# EAGLE schematic CV-module-schematics (EAGLE 6.2)

## Sheet 1 of 2
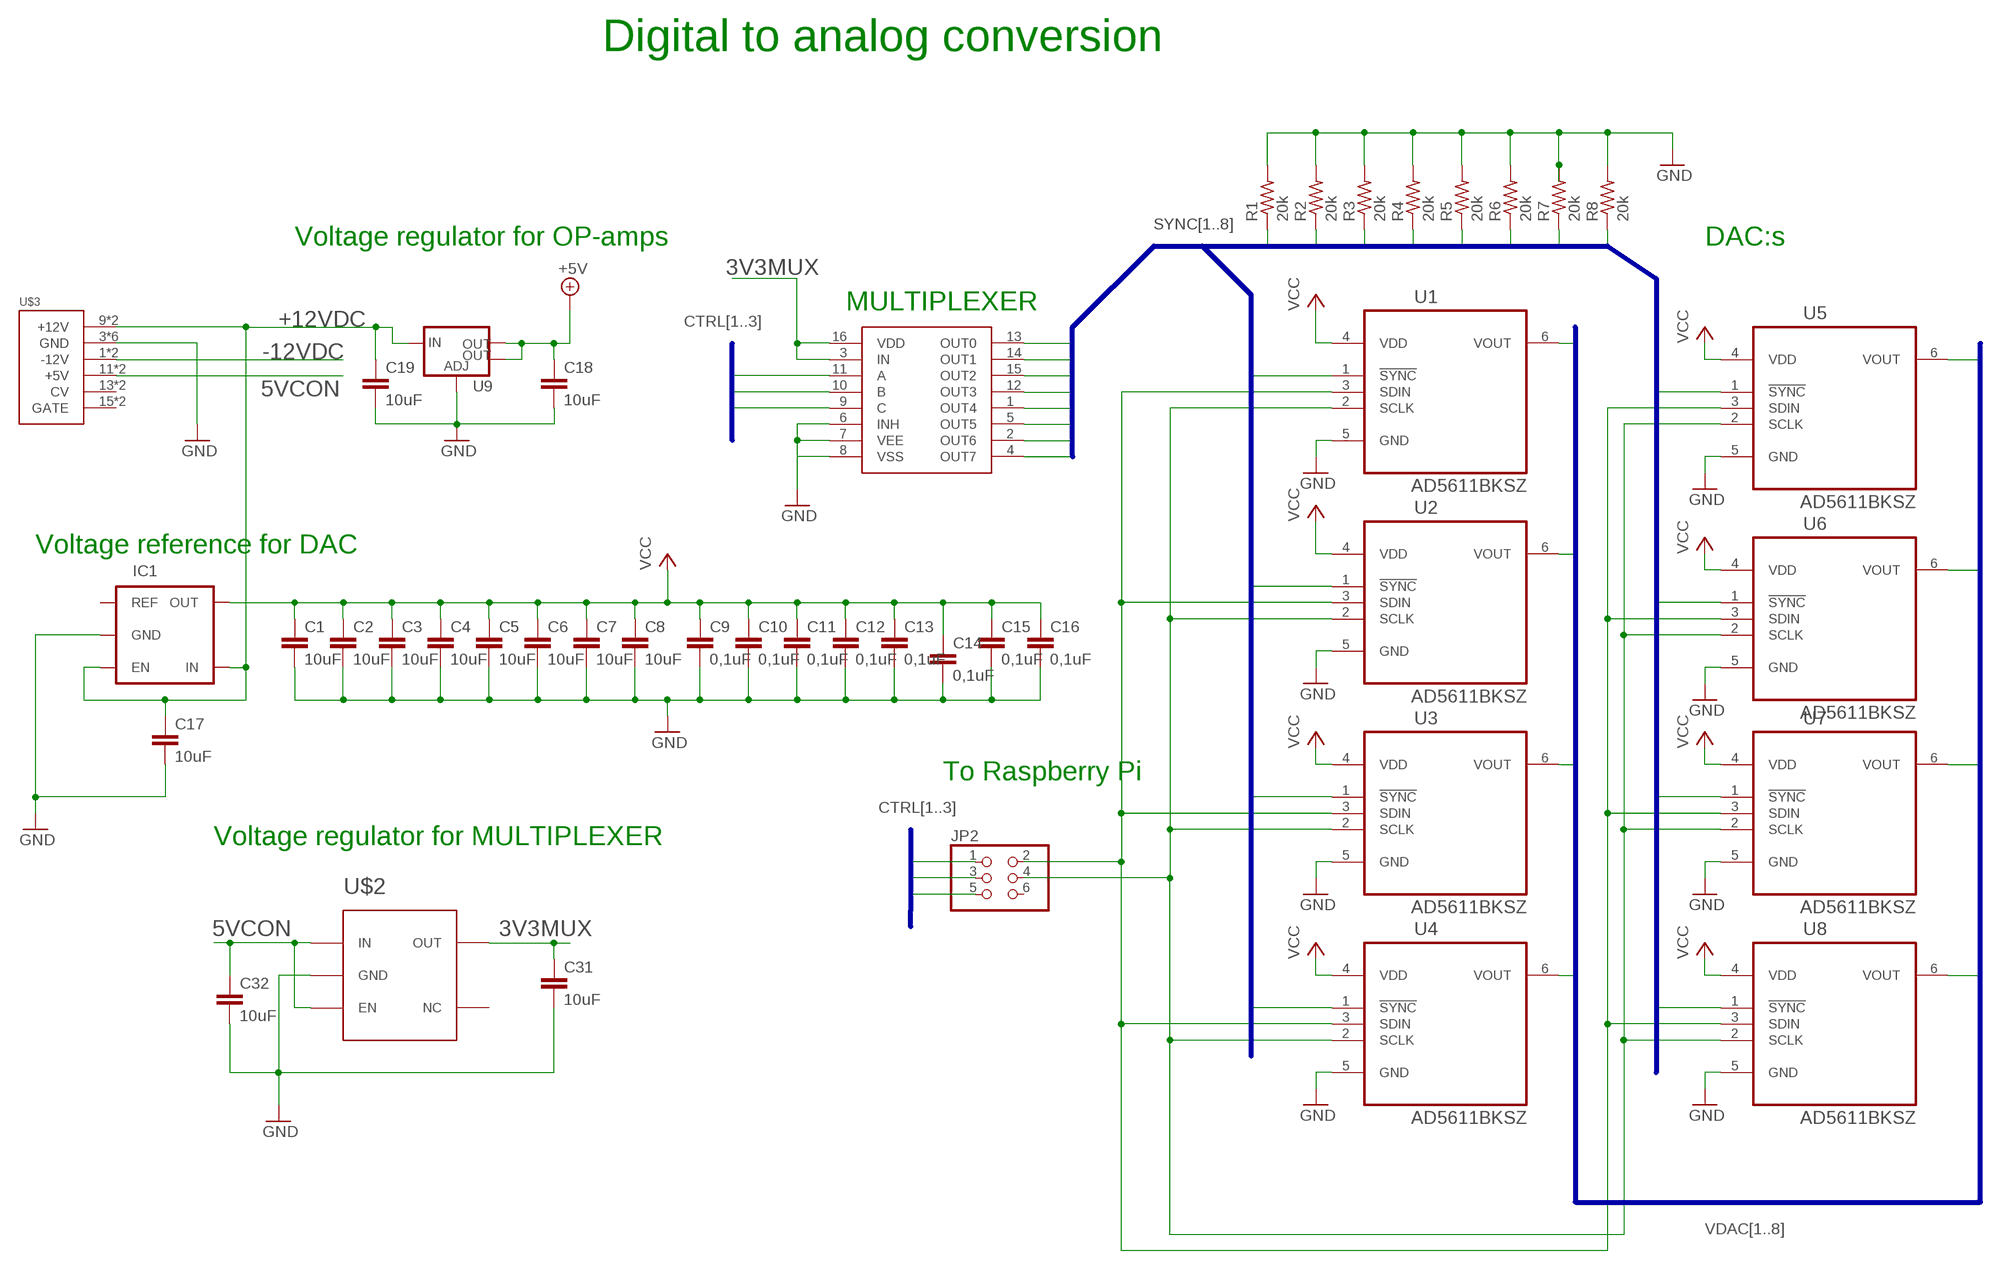
[diagram p0: schematic, sheet 1]

### Parts
C1  10uF  C-EUC1206  [C1206]
C2  10uF  C-EUC1206  [C1206]
C3  10uF  C-EUC1206  [C1206]
C4  10uF  C-EUC1206  [C1206]
C5  10uF  C-EUC1206  [C1206]
C6  10uF  C-EUC1206  [C1206]
C7  10uF  C-EUC1206  [C1206]
C8  10uF  C-EUC1206  [C1206]
C9  0,1uF  C-EUC0603  [C0603]
C10  0,1uF  C-EUC0603  [C0603]
C11  0,1uF  C-EUC0603  [C0603]
C12  0,1uF  C-EUC0603  [C0603]
C13  0,1uF  C-EUC0603  [C0603]
C14  0,1uF  C-EUC0603  [C0603]
C15  0,1uF  C-EUC0603  [C0603]
C16  0,1uF  C-EUC0603  [C0603]
C17  10uF  C-EUC1206  [C1206]
C18  10uF  C-EUC1206  [C1206]
C19  10uF  C-EUC1206  [C1206]
C31  10uF  C-EUC1206  [C1206]
C32  10uF  C-EUC1206  [C1206]
IC1  V_REG_TPS76433SOT23-5  [SOT23-5]
JP2  PINHD-2X3  [2X03]
R1  20k  R-US_R0603  [R0603]
R2  20k  R-US_R0603  [R0603]
R3  20k  R-US_R0603  [R0603]
R4  20k  R-US_R0603  [R0603]
R5  20k  R-US_R0603  [R0603]
R6  20k  R-US_R0603  [R0603]
R7  20k  R-US_R0603  [R0603]
R8  20k  R-US_R0603  [R0603]
U1  AD5611BKSZ  [SOT65P210X110-6N]
U2  AD5611BKSZ  [SOT65P210X110-6N]
U3  AD5611BKSZ  [SOT65P210X110-6N]
U4  AD5611BKSZ  [SOT65P210X110-6N]
U5  AD5611BKSZ  [SOT65P210X110-6N]
U6  AD5611BKSZ  [SOT65P210X110-6N]
U7  AD5611BKSZ  [SOT65P210X110-6N]
U8  AD5611BKSZ  [SOT65P210X110-6N]
U9  V_REG_LM1117SOT223  [SOT223]
U$1  CD4051BM96  [N5]
U$2  TVL713  [SOT23-5]
U$3  POWER  [POWER_16]

### Nets
3V3MUX: C31.1 U$1.3(IN) U$1.16(VDD) U$2.5(OUT)
5VCON: C32.1 U$2.1(IN) U$2.3(EN) U$3.11(+5V) U$3.12(+5V)
+5V: C18.1 U9.2(OUT) U9.4(OUT) ; also sheet 2
+12VDC: C17.1 C19.1 IC1.3(EN) IC1.4(IN) U9.3(IN) U$3.9(+12V) U$3.10(+12V) ; also sheet 2
-12VDC: U$3.1(-12V) U$3.2(-12V) ; also sheet 2
CTRL1: JP2.1 U$1.11(A)
CTRL2: JP2.3 U$1.10(B)
CTRL3: JP2.5 U$1.9(C)
GND: C1.2 C2.2 C3.2 C4.2 C5.2 C6.2 C7.2 C8.2 C9.2 C10.2 C11.2 C12.2 C13.2 C14.2 C15.2 C16.2 C17.2 C18.2 C19.2 C31.2 C32.2 IC1.2(GND) R1.2 R2.2 R3.2 R4.2 R5.2 R6.2 R7.2 R8.2 U1.5(GND) U2.5(GND) U3.5(GND) U4.5(GND) U5.5(GND) U6.5(GND) U7.5(GND) U8.5(GND) U9.1(ADJ) U$1.6(INH) U$1.7(VEE) U$1.8(VSS) U$2.2(GND) U$3.3(GND) U$3.4(GND) U$3.5(GND) U$3.6(GND) U$3.7(GND) U$3.8(GND) ; also sheet 2
N$1: JP2.2 U1.3(SDIN) U2.3(SDIN) U3.3(SDIN) U4.3(SDIN) U5.3(SDIN) U6.3(SDIN) U7.3(SDIN) U8.3(SDIN)
N$2: JP2.4 U1.2(SCLK) U2.2(SCLK) U3.2(SCLK) U4.2(SCLK) U5.2(SCLK) U6.2(SCLK) U7.2(SCLK) U8.2(SCLK)
SYNC1: R1.1 U1.1(!SYNC) U$1.13(OUT0)
SYNC2: R2.1 U2.1(!SYNC) U$1.14(OUT1)
SYNC3: R3.1 U3.1(!SYNC) U$1.15(OUT2)
SYNC4: R4.1 U4.1(!SYNC) U$1.12(OUT3)
SYNC5: R5.1 U5.1(!SYNC) U$1.1(OUT4)
SYNC6: R6.1 U8.1(!SYNC) U$1.5(OUT5)
SYNC7: R7.1 U6.1(!SYNC) U$1.2(OUT6)
SYNC8: R8.1 U7.1(!SYNC) U$1.4(OUT7)
VCC: C1.1 C2.1 C3.1 C4.1 C5.1 C6.1 C7.1 C8.1 C9.1 C10.1 C11.1 C12.1 C13.1 C14.1 C15.1 C16.1 IC1.5(OUT) U1.4(VDD) U2.4(VDD) U3.4(VDD) U4.4(VDD) U5.4(VDD) U6.4(VDD) U7.4(VDD) U8.4(VDD)
VDAC1: U1.6(VOUT) ; also sheet 2
VDAC2: U2.6(VOUT) ; also sheet 2
VDAC3: U3.6(VOUT) ; also sheet 2
VDAC4: U4.6(VOUT) ; also sheet 2
VDAC5: U5.6(VOUT) ; also sheet 2
VDAC6: U6.6(VOUT) ; also sheet 2
VDAC7: U7.6(VOUT) ; also sheet 2
VDAC8: U8.6(VOUT) ; also sheet 2
Unconnected: IC1.1(REF) JP2.6 U$2.4(NC) U$3.13(CV) U$3.14(CV) U$3.15(GATE) U$3.16(GATE)

### Buses
SYNC[1..8]
VDAC[1..8]
CTRL[1..3]

### Notes on the sheet
- Digital to analog conversion
- Voltage regulator for OP-amps | DAC:s
- MULTIPLEXER
- Voltage reference for DAC
- To Raspberry Pi
- Voltage regulator for MULTIPLEXER

## Sheet 2 of 2
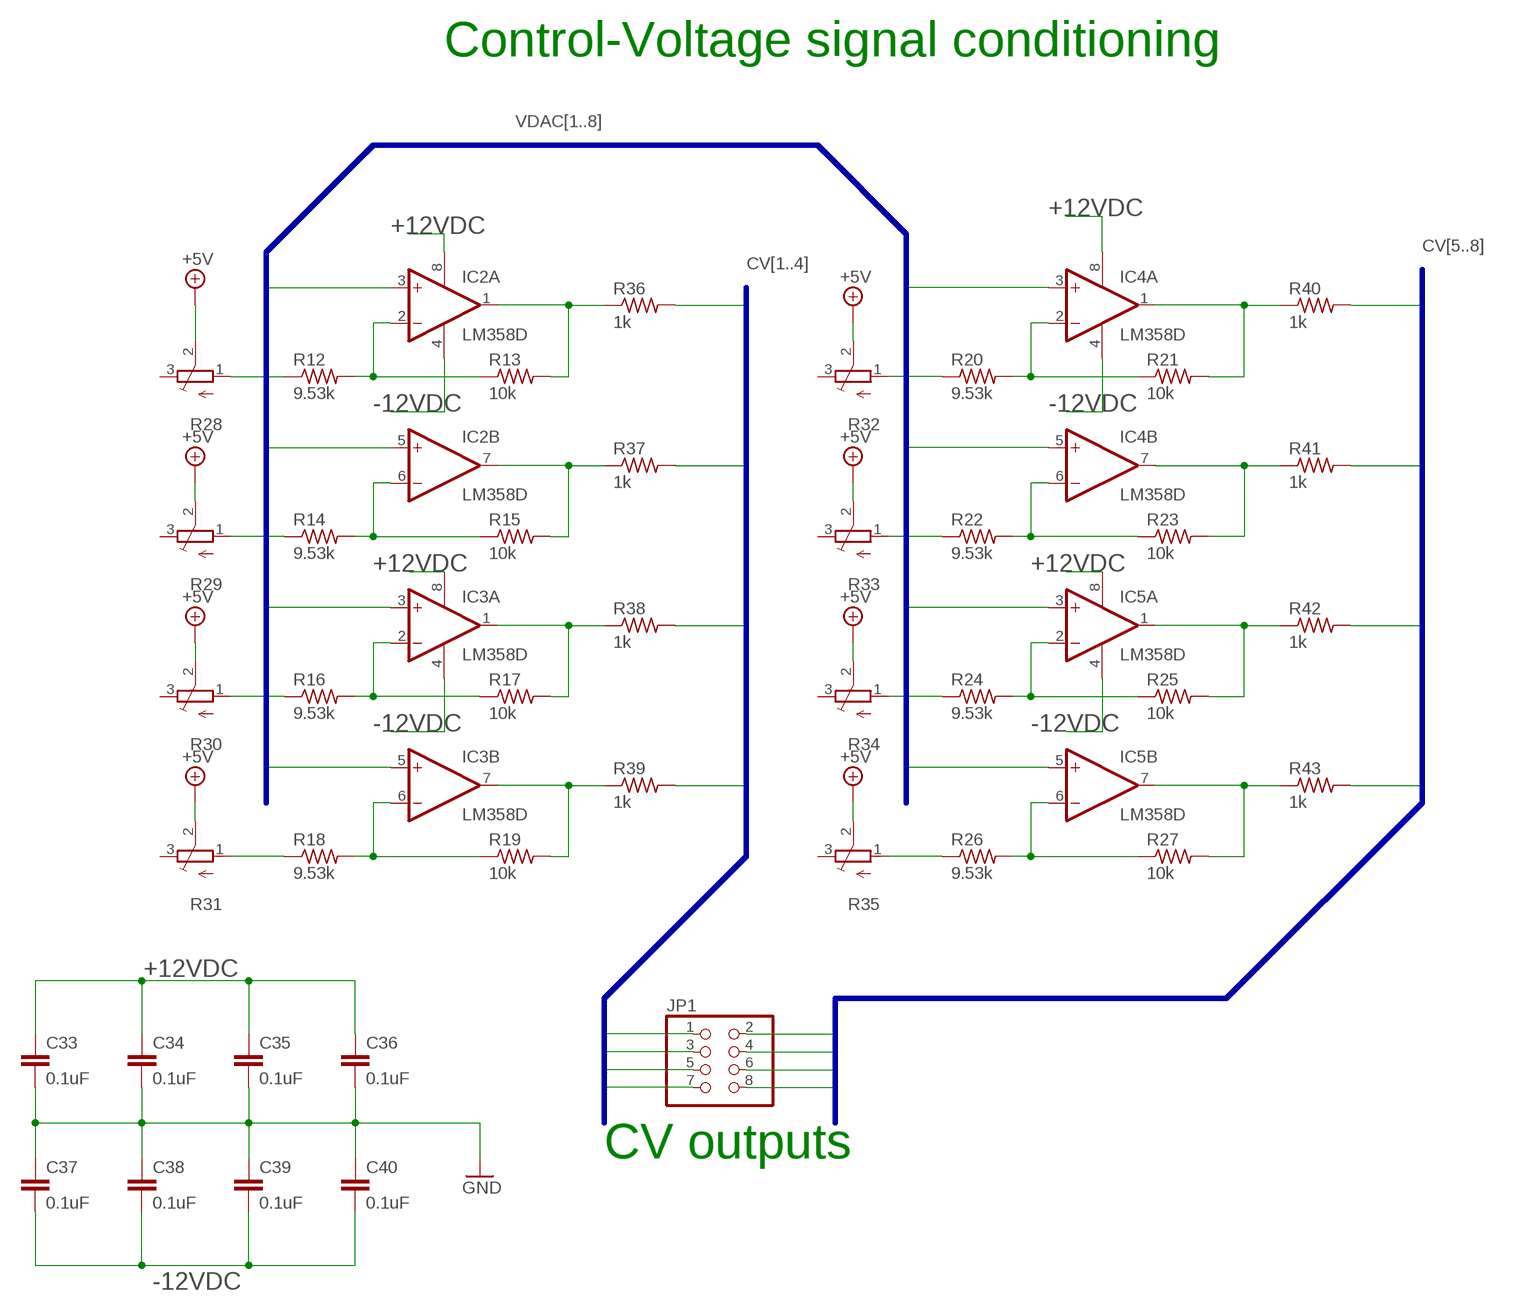
[diagram p1: schematic, sheet 2]

### Parts
C33  0.1uF  C-EUC0603  [C0603]
C34  0.1uF  C-EUC0603  [C0603]
C35  0.1uF  C-EUC0603  [C0603]
C36  0.1uF  C-EUC0603  [C0603]
C37  0.1uF  C-EUC0603  [C0603]
C38  0.1uF  C-EUC0603  [C0603]
C39  0.1uF  C-EUC0603  [C0603]
C40  0.1uF  C-EUC0603  [C0603]
IC2  LM358D  [SO08]
IC3  LM358D  [SO08]
IC4  LM358D  [SO08]
IC5  LM358D  [SO08]
JP1  PINHD-2X4  [2X04]
R12  9.53k  R-US_R0603  [R0603]
R13  10k  R-US_R0603  [R0603]
R14  9.53k  R-US_R0603  [R0603]
R15  10k  R-US_R0603  [R0603]
R16  9.53k  R-US_R0603  [R0603]
R17  10k  R-US_R0603  [R0603]
R18  9.53k  R-US_R0603  [R0603]
R19  10k  R-US_R0603  [R0603]
R20  9.53k  R-US_R0603  [R0603]
R21  10k  R-US_R0603  [R0603]
R22  9.53k  R-US_R0603  [R0603]
R23  10k  R-US_R0603  [R0603]
R24  9.53k  R-US_R0603  [R0603]
R25  10k  R-US_R0603  [R0603]
R26  9.53k  R-US_R0603  [R0603]
R27  10k  R-US_R0603  [R0603]
R28  TRIM_EU-3223W  [3223W]
R29  TRIM_EU-3223W  [3223W]
R30  TRIM_EU-3223W  [3223W]
R31  TRIM_EU-3223W  [3223W]
R32  TRIM_EU-3223W  [3223W]
R33  TRIM_EU-3223W  [3223W]
R34  TRIM_EU-3223W  [3223W]
R35  TRIM_EU-3223W  [3223W]
R36  1k  R-US_R0603  [R0603]
R37  1k  R-US_R0603  [R0603]
R38  1k  R-US_R0603  [R0603]
R39  1k  R-US_R0603  [R0603]
R40  1k  R-US_R0603  [R0603]
R41  1k  R-US_R0603  [R0603]
R42  1k  R-US_R0603  [R0603]
R43  1k  R-US_R0603  [R0603]

### Nets
+5V: R28.2(S) R29.2(S) R30.2(S) R31.2(S) R32.2(S) R33.2(S) R34.2(S) R35.2(S) ; also sheet 1
+12VDC: C33.1 C34.1 C35.1 C36.1 IC2.8(P:V+) IC3.8(P:V+) IC4.8(P:V+) IC5.8(P:V+) ; also sheet 1
-12VDC: C37.2 C38.2 C39.2 C40.2 IC2.4(P:V-) IC3.4(P:V-) IC4.4(P:V-) IC5.4(P:V-) ; also sheet 1
CV1: JP1.1 R37.2
CV2: JP1.3 R36.2
CV3: JP1.5 R39.2
CV4: JP1.7 R38.2
CV5: JP1.2 R42.2
CV6: JP1.4 R43.2
CV7: JP1.6 R40.2
CV8: JP1.8 R41.2
GND: C33.2 C34.2 C35.2 C36.2 C37.1 C38.1 C39.1 C40.1 ; also sheet 1
N$4: IC2.2(A:-IN) R12.2 R13.1
N$5: R12.1 R28.1(A)
N$6: IC2.1(A:OUT) R13.2 R36.1
N$7: R14.1 R29.1(A)
N$8: IC2.6(B:-IN) R14.2 R15.1
N$9: IC3.2(A:-IN) R16.2 R17.1
N$10: R16.1 R30.1(A)
N$11: IC3.6(B:-IN) R18.2 R19.1
N$12: R18.1 R31.1(A)
N$13: IC3.7(B:OUT) R19.2 R39.1
N$14: IC3.1(A:OUT) R17.2 R38.1
N$15: IC2.7(B:OUT) R15.2 R37.1
N$16: IC4.2(A:-IN) R20.2 R21.1
N$17: IC4.1(A:OUT) R21.2 R40.1
N$18: IC4.7(B:OUT) R23.2 R41.1
N$19: IC4.6(B:-IN) R22.2 R23.1
N$20: IC5.2(A:-IN) R24.2 R25.1
N$21: IC5.1(A:OUT) R25.2 R42.1
N$22: R24.1 R34.1(A)
N$23: IC5.6(B:-IN) R26.2 R27.1
N$24: IC5.7(B:OUT) R27.2 R43.1
N$25: R26.1 R35.1(A)
N$26: R20.1 R32.1(A)
N$27: R22.1 R33.1(A)
VDAC1: IC2.3(A:+IN) ; also sheet 1
VDAC2: IC2.5(B:+IN) ; also sheet 1
VDAC3: IC3.3(A:+IN) ; also sheet 1
VDAC4: IC3.5(B:+IN) ; also sheet 1
VDAC5: IC4.3(A:+IN) ; also sheet 1
VDAC6: IC4.5(B:+IN) ; also sheet 1
VDAC7: IC5.3(A:+IN) ; also sheet 1
VDAC8: IC5.5(B:+IN) ; also sheet 1
Unconnected: R28.3(E) R29.3(E) R30.3(E) R31.3(E) R32.3(E) R33.3(E) R34.3(E) R35.3(E)

### Buses
CV[1..4]
CV[5..8]
VDAC[1..8]

### Notes on the sheet
- Control-Voltage signal conditioning
- CV outputs

## Library data of the parts
C1-C19 C31-C40 = resistor:C-EU: CAPACITOR, European symbol
IC1 = SparkFun-PowerIC:V_REG_TPS76433: Voltage Regulator Older TI part. LDO 150mA regulator. No output by-pass cap option. See V_REG_LDO for a better part.
IC2-IC5 = linear:LM358: OP AMP also LM158; LM258; LM2904 Source: http://cache.national.com/ds/LM/LM158.pdf
JP1 = pinhead:PINHD-2X4: PIN HEADER
JP2 = pinhead:PINHD-2X3: PIN HEADER
R1-R8 = rcl:R-US_: RESISTOR, American symbol
R12-R27 R36-R43 = resistor:R-US_: RESISTOR, American symbol
R28-R35 = pot:TRIM_EU-: POTENTIOMETER
U1-U8 = AD5611BKSZ:AD5611BKSZ: IC,2.7 V to 5.5 V, <100 mA, 8-/10-/12-Bit nanoDAC, SPI Interface in LFCSP and SC70- SC70-6; MPN: AD5611BKSZ; OC_FARNELL: 2096189; OC_NEWARK: 91T4795; PACKAGE: SC-70-6; SUPPLIER: Analog Devices
U9 = SparkFun-PowerIC:V_REG_LM1117: Voltage Regulator LM1117 Standard adjustable voltage regulator but in SMD form. Spark Fun Electronics SKU : COM-00595; PROD_ID: VREG-08170
U$1 = halo-electronics:CD4051BM96: TEXAS INSTRUMENTS CD4051BM96 MUX, SINGLE, 8CH, SOIC-16
U$2 = Pekkas_libraries:TVL713: TEXAS INSTRUMENTS TLV71333PDBVR Fixed LDO Voltage Regulator, 1.4V to 5.5V, 230mV Dropout, 3.3Vout, 150mAout, SOT-23-5
U$3 = eurorack:POWER